# EAGLE schematic potboard (EAGLE 9.5.2)
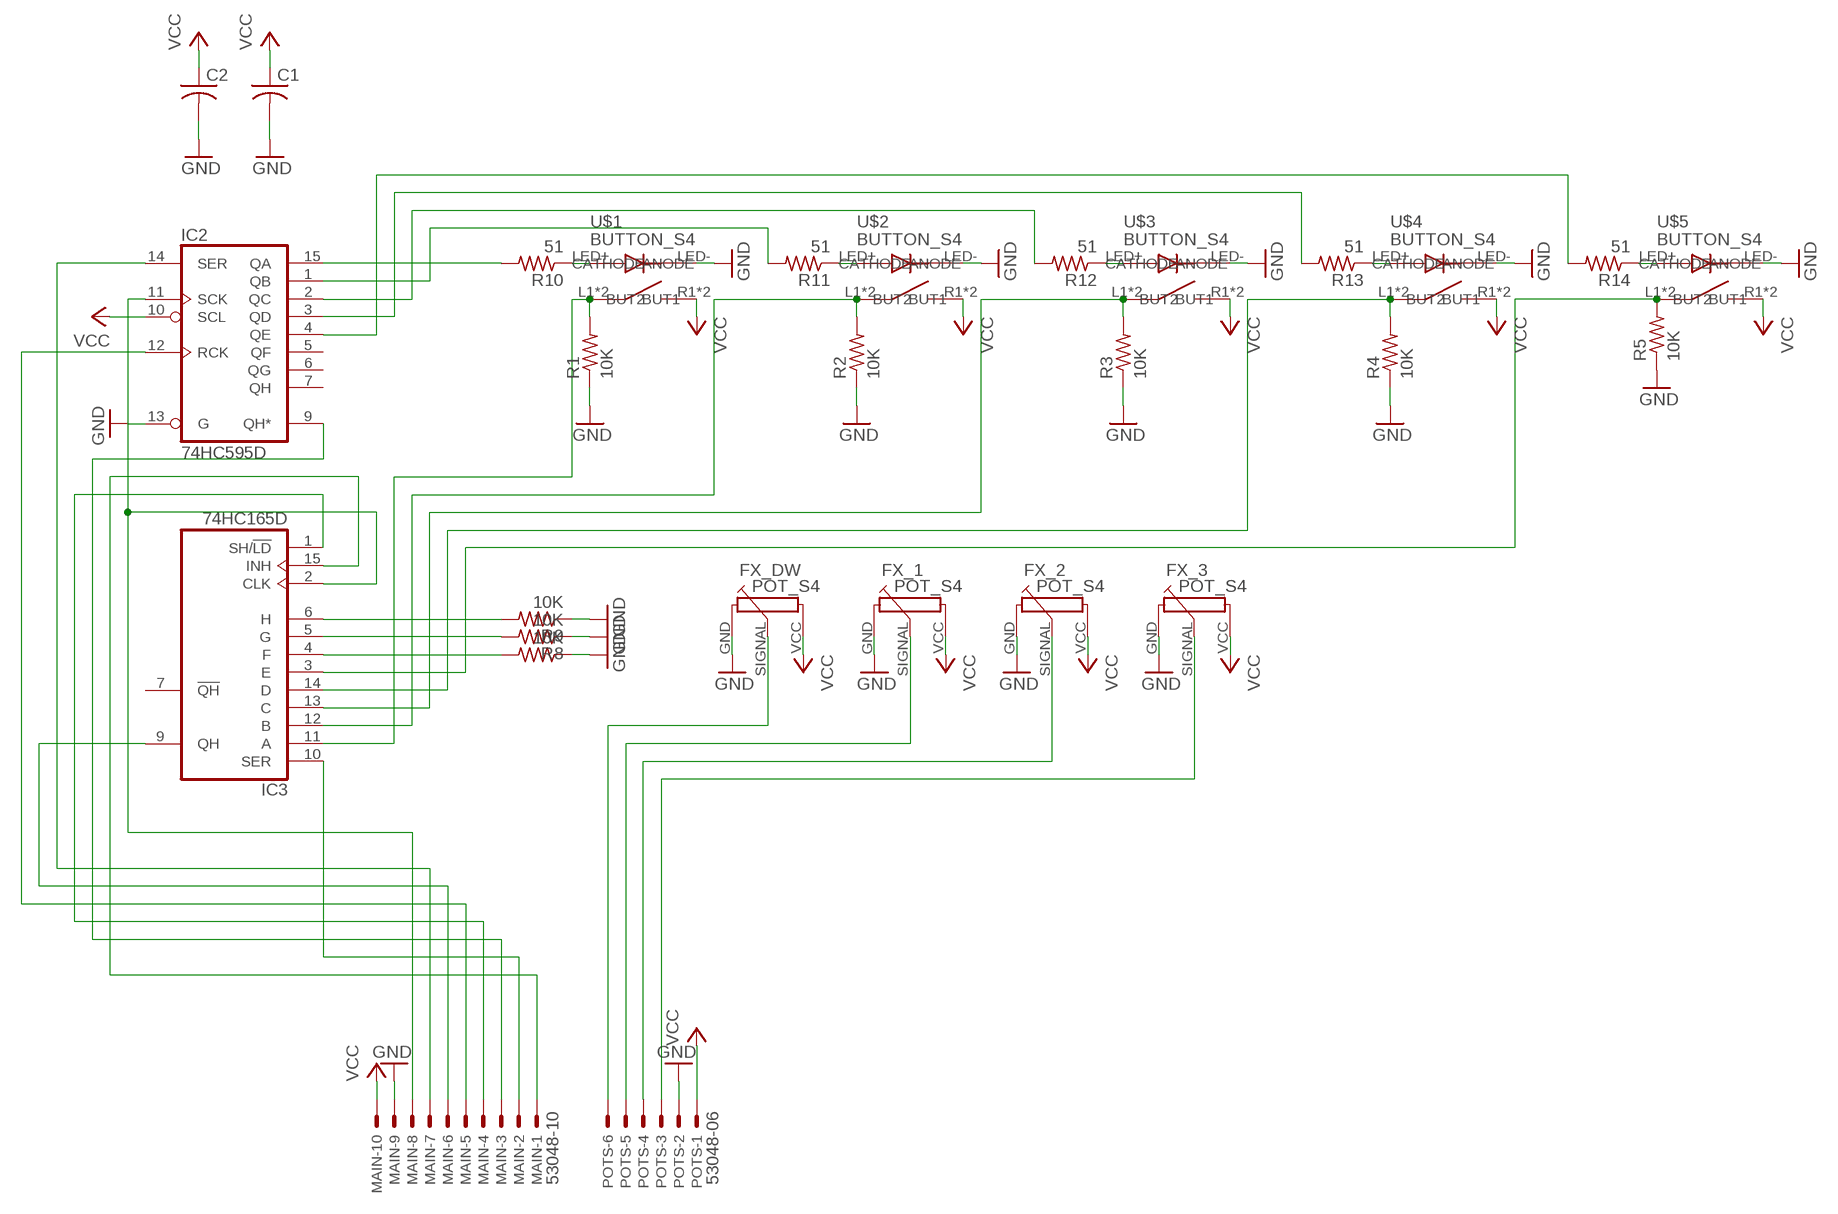
[diagram p0: schematic, sheet 1]

## Parts
C1  C-USC1206  [C1206]
C2  C-USC1206  [C1206]
FX_1  POT_S4  [POT_S4]
FX_2  POT_S4  [POT_S4]
FX_3  POT_S4  [POT_S4]
FX_DW  POT_S4  [POT_S4]
IC2  74HC595D  [SO16]
IC3  74HC165D  [SO16]
MAIN  53048-10  [53048-10]
POTS  53048-06  [53048-06]
R1  10K  R-US_R0805  [R0805]
R2  10K  R-US_R0805  [R0805]
R3  10K  R-US_R0805  [R0805]
R4  10K  R-US_R0805  [R0805]
R5  10K  R-US_R0805  [R0805]
R6  10K  R-US_R0805  [R0805]
R8  10K  R-US_R0805  [R0805]
R9  10K  R-US_R0805  [R0805]
R10  51  R-US_R0805  [R0805]
R11  51  R-US_R0805  [R0805]
R12  51  R-US_R0805  [R0805]
R13  51  R-US_R0805  [R0805]
R14  51  R-US_R0805  [R0805]
U$1  BUTTON_S4  [BUTTON_S4]
U$2  BUTTON_S4  [BUTTON_S4]
U$3  BUTTON_S4  [BUTTON_S4]
U$4  BUTTON_S4  [BUTTON_S4]
U$5  BUTTON_S4  [BUTTON_S4]

## Nets
GND: C1.2 C2.2 FX_1.GND(1A) FX_2.GND(1A) FX_3.GND(1A) FX_DW.GND(1A) IC2.13(G) MAIN.9 POTS.2 R1.1 R2.1 R3.1 R4.1 R5.1 R6.1 R8.1 R9.1 U$1.LED-(CATHODE) U$2.LED-(CATHODE) U$3.LED-(CATHODE) U$4.LED-(CATHODE) U$5.LED-(CATHODE)
N$1: IC2.4(QE) R14.2
N$2: FX_DW.SIGNAL(1S) POTS.6
N$3: FX_1.SIGNAL(1S) POTS.5
N$4: FX_2.SIGNAL(1S) POTS.4
N$5: IC3.11(A) R1.2 U$1.L1(BUT1) U$1.L2(BUT1)
N$6: IC3.12(B) R2.2 U$2.L1(BUT1) U$2.L2(BUT1)
N$7: IC3.13(C) R3.2 U$3.L1(BUT1) U$3.L2(BUT1)
N$8: IC3.14(D) R4.2 U$4.L1(BUT1) U$4.L2(BUT1)
N$9: IC3.3(E) R5.2 U$5.L1(BUT1) U$5.L2(BUT1)
N$10: IC2.3(QD) R13.2
N$11: IC2.2(QC) R12.2
N$12: IC2.1(QB) R11.2
N$13: R10.1 U$1.LED+(ANODE)
N$14: FX_3.SIGNAL(1S) POTS.3
N$15: IC2.11(SCK) IC3.2(CLK) MAIN.8
N$16: IC3.6(H) R9.2
N$17: IC3.5(G) R8.2
N$18: IC3.4(F) R6.2
N$19: IC3.10(SER) MAIN.2
N$20: IC2.15(QA) R10.2
N$21: R11.1 U$2.LED+(ANODE)
N$22: R12.1 U$3.LED+(ANODE)
N$23: R13.1 U$4.LED+(ANODE)
N$24: R14.1 U$5.LED+(ANODE)
N$25: IC2.14(SER) MAIN.7
N$26: IC2.9(QH*) MAIN.3
N$27: IC2.12(RCK) MAIN.5
N$28: IC3.1(SH/!LD) MAIN.4
N$29: IC3.9(QH) MAIN.6
N$30: IC3.15(INH) MAIN.1
VCC: C1.1 C2.1 FX_1.VCC(1E) FX_2.VCC(1E) FX_3.VCC(1E) FX_DW.VCC(1E) IC2.10(SCL) MAIN.10 POTS.1 U$1.R1(BUT2) U$1.R2(BUT2) U$2.R1(BUT2) U$2.R2(BUT2) U$3.R1(BUT2) U$3.R2(BUT2) U$4.R1(BUT2) U$4.R2(BUT2) U$5.R1(BUT2) U$5.R2(BUT2)
Unconnected: IC2.5(QF) IC2.6(QG) IC2.7(QH) IC3.7(!QH)

## Power pins joined to a net without a drawn wire
GND: IC2.8(GND) IC3.8(GND)
VCC: IC2.16(VCC) IC3.16(VCC)

## Library data of the parts
C1 C2 = adafruit:C-US: CAPACITOR, American symbol
FX_1-FX_3 FX_DW = S4:POT_S4
IC2 = 74xx-eu:74*595: 8-bit SHIFT REGISTER, output latch
IC3 = 74xx-eu:74*165: 8-bit parallel load SHIFT REGISTER
MAIN = con-molex:53?-10: CONNECTOR wire to board 1.25 mm (.049 inch) pitch header; MF: MOLEX; MPN: 53048-1010; OC_FARNELL: 9733108; OC_NEWARK: 98K9838
POTS = con-molex:53?-06: CONNECTOR wire to board 1.25 mm (.049 inch) pitch header; MF: WALDOM/MOLEX; MPN: 53048-0610; OC_FARNELL: 1012260; OC_NEWARK: 38C9911
R1-R6 R8-R14 = rcl:R-US_: RESISTOR, American symbol; SPICEPREFIX: R
U$1-U$5 = S4:BUTTON_S4